# Altium schematic sheet 盟升杯.SchDoc
size A3
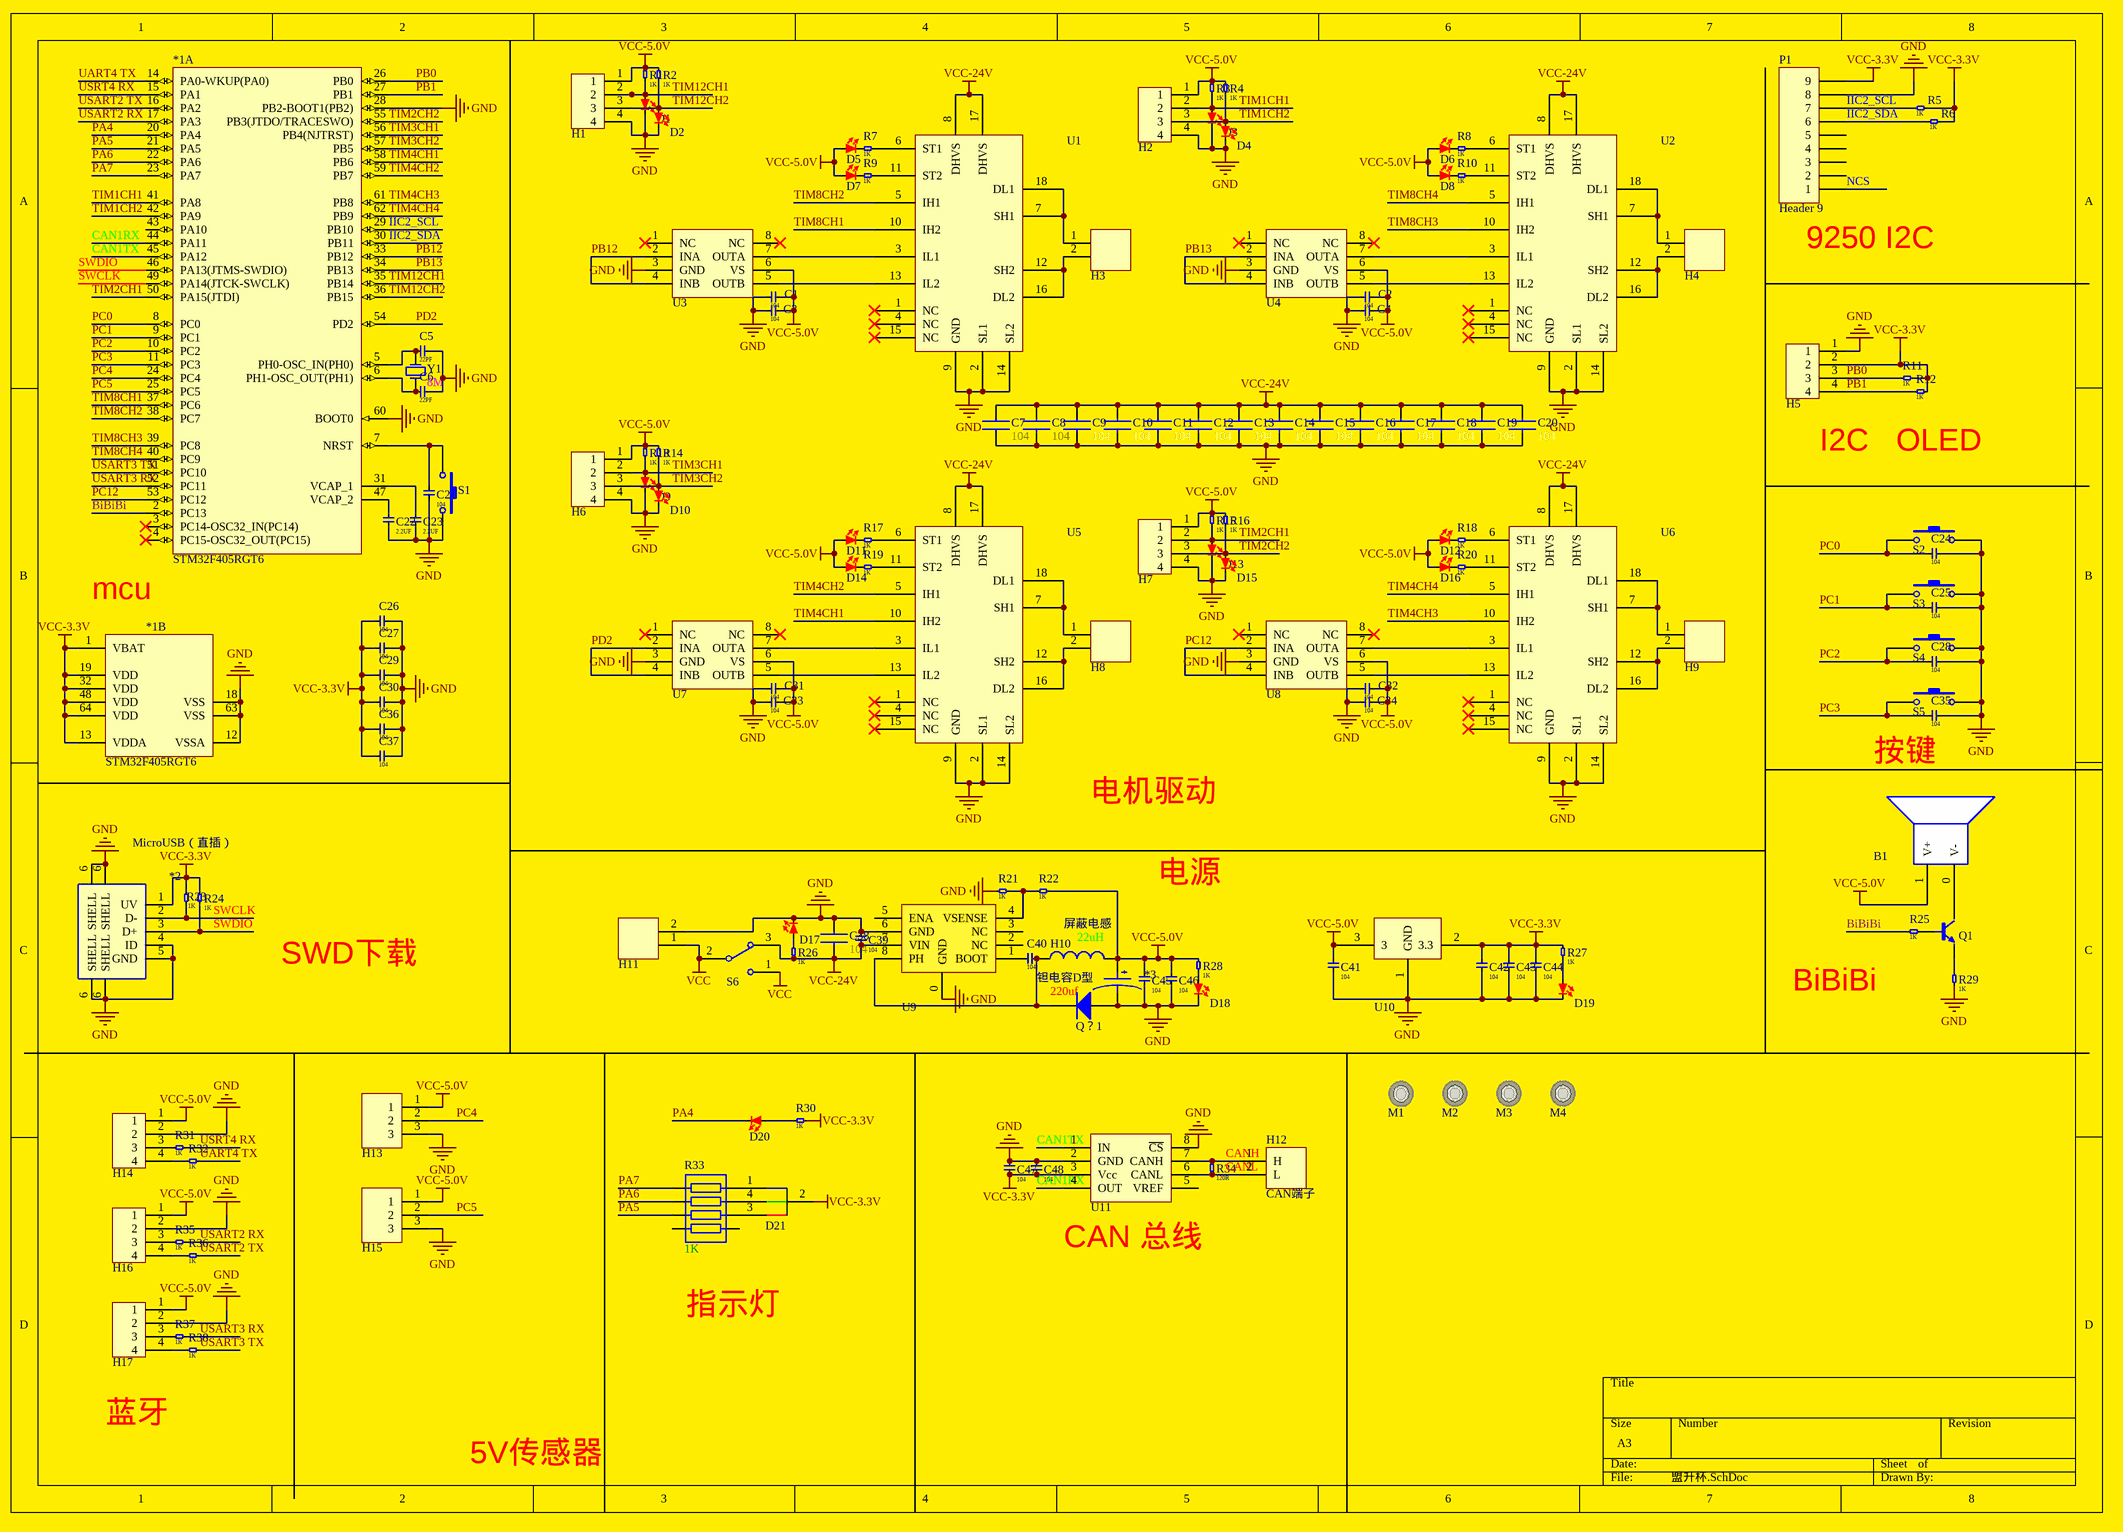
[diagram p0: 盟升杯.SchDoc]

## Parts
*1  STM32F405RGT6  [LQFP_64P]  (parts A,B of 2)
*2  MicroUSB（直插）  [MicroUSB（直插）]
*3  钽电容D型  [钽电容D型]
B1  KLJ-9032  [KLJ-9032]  (value not drawn)
C1  CAP0603  [CAP0603]  (value not drawn)
C2  CAP0603  [CAP0603]  (value not drawn)
C3  CAP0603  [CAP0603]  (value not drawn)
C4  CAP0603  [CAP0603]  (value not drawn)
C5  CAP0603  [CAP0603]  (value not drawn)
C6  CAP0603  [CAP0603]  (value not drawn)
C7  CAP1812  [CAP1812]  (value not drawn)
C8  CAP1812  [CAP1812]  (value not drawn)
C9  CAP1210  [CAP1210]  (value not drawn)
C10  CAP1210  [CAP1210]  (value not drawn)
C11  CAP1210  [CAP1210]  (value not drawn)
C12  CAP1210  [CAP1210]  (value not drawn)
C13  CAP1210  [CAP1210]  (value not drawn)
C14  CAP1210  [CAP1210]  (value not drawn)
C15  CAP1210  [CAP1210]  (value not drawn)
C16  CAP1210  [CAP1210]  (value not drawn)
C17  CAP1210  [CAP1210]  (value not drawn)
C18  CAP1210  [CAP1210]  (value not drawn)
C19  CAP1210  [CAP1210]  (value not drawn)
C20  CAP1210  [CAP1210]  (value not drawn)
C21  CAP0603  [CAP0603]  (value not drawn)
C22  CAP0603  [CAP0603]  (value not drawn)
C23  CAP0603  [CAP0603]  (value not drawn)
C24  CAP0603  [CAP0603]  (value not drawn)
C25  CAP0603  [CAP0603]  (value not drawn)
C26  CAP0603  [CAP0603]  (value not drawn)
C27  CAP0603  [CAP0603]  (value not drawn)
C28  CAP0603  [CAP0603]  (value not drawn)
C29  CAP0603  [CAP0603]  (value not drawn)
C30  CAP0603  [CAP0603]  (value not drawn)
C31  CAP0603  [CAP0603]  (value not drawn)
C32  CAP0603  [CAP0603]  (value not drawn)
C33  CAP0603  [CAP0603]  (value not drawn)
C34  CAP0603  [CAP0603]  (value not drawn)
C35  CAP0603  [CAP0603]  (value not drawn)
C36  CAP0603  [CAP0603]  (value not drawn)
C37  CAP0603  [CAP0603]  (value not drawn)
C38  CAP1812  [CAP1812]  (value not drawn)
C39  CAP0603  [CAP0603]  (value not drawn)
C40  CAP0603  [CAP0603]  (value not drawn)
C41  CAP0603  [CAP0603]  (value not drawn)
C42  CAP0603  [CAP0603]  (value not drawn)
C43  CAP0603  [CAP0603]  (value not drawn)
C44  CAP0603  [CAP0603]  (value not drawn)
C45  CAP0603  [CAP0603]  (value not drawn)
C46  CAP0603  [CAP0603]  (value not drawn)
C47  CAP0603  [CAP0603]  (value not drawn)
C48  104  [CAP]
D1  LED  [LED_0603_B]  (value not drawn)
D2  LED  [LED_0603_B]  (value not drawn)
D3  LED  [LED_0603_B]  (value not drawn)
D4  LED  [LED_0603_B]  (value not drawn)
D5  LED  [LED_0603_B]  (value not drawn)
D6  LED  [LED_0603_B]  (value not drawn)
D7  LED  [LED_0603_G]  (value not drawn)
D8  LED  [LED_0603_G]  (value not drawn)
D9  LED  [LED_0603_B]  (value not drawn)
D10  LED  [LED_0603_B]  (value not drawn)
D11  LED  [LED_0603_B]  (value not drawn)
D12  LED  [LED_0603_B]  (value not drawn)
D13  LED  [LED_0603_B]  (value not drawn)
D14  LED  [LED_0603_G]  (value not drawn)
D15  LED  [LED_0603_B]  (value not drawn)
D16  LED  [LED_0603_G]  (value not drawn)
D17  LED  [LED_0603_R]  (value not drawn)
D18  LED  [LED_0603_R]  (value not drawn)
D19  LED  [LED_0603_R]  (value not drawn)
D20  LED  [LED_0603_R]  (value not drawn)
D21  RGB  [RGB]  (value not drawn)
H1  H4  [H4_WHITE]  (value not drawn)
H2  H4  [H4_WHITE]  (value not drawn)
H3  H2 POWER  [H2 POWER]  (value not drawn)
H4  H2 POWER  [H2 POWER]  (value not drawn)
H5  H4  [H4]  (value not drawn)
H6  H4  [H4_WHITE]  (value not drawn)
H7  H4  [H4_WHITE]  (value not drawn)
H8  H2 POWER  [H2 POWER]  (value not drawn)
H9  H2 POWER  [H2 POWER]  (value not drawn)
H10  屏蔽电感  [屏蔽7.2*7.2]
H11  H2 POWER  [H2 POWER]  (value not drawn)
H12  CAN端子  [CAN端子]
H13  H3  [H3_WHITE]  (value not drawn)
H14  H4  [H4]  (value not drawn)
H15  H3  [H3_WHITE]  (value not drawn)
H16  H4  [H4]  (value not drawn)
H17  H4  [H4]  (value not drawn)
M1  M3过孔  [M3过孔]  (value not drawn)
M2  M3过孔  [M3过孔]  (value not drawn)
M3  M3过孔  [M3过孔]  (value not drawn)
M4  M3过孔  [M3过孔]  (value not drawn)
P1  Header 9  [HDR1X9]
Q1  2N5551  [2N5551]  (value not drawn)
Q？1  SS34  [SS34]  (value not drawn)
R1  电阻R  [R0603]  (value not drawn)
R2  电阻R  [R0603]  (value not drawn)
R3  电阻R  [R0603]  (value not drawn)
R4  电阻R  [R0603]  (value not drawn)
R5  电阻R  [R0603]  (value not drawn)
R6  电阻R  [R0603]  (value not drawn)
R7  电阻R  [R0603]  (value not drawn)
R8  电阻R  [R0603]  (value not drawn)
R9  电阻R  [R0603]  (value not drawn)
R10  电阻R  [R0603]  (value not drawn)
R11  电阻R  [R0603]  (value not drawn)
R12  电阻R  [R0805]  (value not drawn)
R13  电阻R  [R0603]  (value not drawn)
R14  电阻R  [R0603]  (value not drawn)
R15  电阻R  [R0603]  (value not drawn)
R16  电阻R  [R0603]  (value not drawn)
R17  电阻R  [R0603]  (value not drawn)
R18  电阻R  [R0603]  (value not drawn)
R19  电阻R  [R0603]  (value not drawn)
R20  电阻R  [R0603]  (value not drawn)
R21  电阻R  [R0603]  (value not drawn)
R22  电阻R  [R0603]  (value not drawn)
R23  电阻R  [R0603]  (value not drawn)
R24  电阻R  [R0603]  (value not drawn)
R25  电阻R  [R0603]  (value not drawn)
R26  电阻R  [R0603]  (value not drawn)
R27  电阻R  [R0603]  (value not drawn)
R28  电阻R  [R0603]  (value not drawn)
R29  电阻R  [R0603]  (value not drawn)
R30  电阻R  [R0603]  (value not drawn)
R31  电阻R  [R0603]  (value not drawn)
R32  电阻R  [R0603]  (value not drawn)
R33  1K*4排阻  [1K*4排阻]  (value not drawn)
R34  电阻R  [R0603]  (value not drawn)
R35  电阻R  [R0603]  (value not drawn)
R36  电阻R  [R0603]  (value not drawn)
R37  电阻R  [R0603]  (value not drawn)
R38  电阻R  [R0603]  (value not drawn)
S1  SWITCH  [SWITCH]  (value not drawn)
S2  SWITCH  [SWITCH]  (value not drawn)
S3  SWITCH  [SWITCH]  (value not drawn)
S4  SWITCH  [SWITCH]  (value not drawn)
S5  SWITCH  [SWITCH]  (value not drawn)
S6  拨动开关  [拨动开关]  (value not drawn)
U1  BTS7810K  [BTS7810K]  (value not drawn)
U2  BTS7810K  [BTS7810K]  (value not drawn)
U3  MIC4428  [SOIC-NB-8]  (value not drawn)
U4  MIC4428  [SOIC-NB-8]  (value not drawn)
U5  BTS7810K  [BTS7810K]  (value not drawn)
U6  BTS7810K  [BTS7810K]  (value not drawn)
U7  MIC4428  [SOIC-NB-8]  (value not drawn)
U8  MIC4428  [SOIC-NB-8]  (value not drawn)
U9  TPS5430  [POWERPARK SOP8]  (value not drawn)
U10  AMS1117  [AMS1117]  (value not drawn)
U11  VP230  [VP230]  (value not drawn)
Y1  XTAL  [XTAL]  (value not drawn)

## Nets
GND: *1.12(VSSA) *1.18(VSS) *1.28(PB2-BOOT1(PB2)) *1.60(BOOT0) *1.63(VSS) *2.4(ID) *2.5(GND) *2.6(SHELL) *3.1 C1.2 C2.2 C3.2 C4.2 C5.2 C6.2 C7.1 C8.1 C9.1 C10.1 C11.1 C12.1 C13.1 C14.1 C15.1 C16.1 C17.1 C18.1 C19.1 C20.1 C21.1 C22.1 C23.1 C24.2 C25.2 C26.1 C27.2 C28.2 C29.2 C30.2 C31.2 C32.2 C33.2 C34.2 C35.2 C36.2 C37.2 C38.2 C39.2 C41.1 C42.1 C43.1 C44.1 C45.1 C46.1 C47.2 C48.2 D1.2 D2.2 D3.2 D4.2 D9.2 D10.2 D13.2 D15.2 D17.2 D18.2 D19.2 H1.4 H2.4 H5.1 H6.4 H7.4 H11.2 H13.3 H14.2 H15.3 H16.2 H17.2 P1.8 Q？1.1(A) R21.1 R29.1 S1.2 S2.2 S3.2 S4.2 S5.2 U1.2(SL1) U1.9(GND) U1.14(SL2) U2.2(SL1) U2.9(GND) U2.14(SL2) U3.3(GND) U4.3(GND) U5.2(SL1) U5.9(GND) U5.14(SL2) U6.2(SL1) U6.9(GND) U6.14(SL2) U7.3(GND) U8.3(GND) U9.0(GND) U9.6(GND) U10.1(GND) U11.2(GND) U11.8(~{CS})
VCC: H11.1 S6.1 S6.2
VCC-3.3V: *1.1(VBAT) *1.13(VDDA) *1.19(VDD) *1.32(VDD) *1.48(VDD) *1.64(VDD) *2.1(UV) C26.2 C27.1 C29.1 C30.1 C36.1 C37.1 C42.2 C43.2 C44.2 C47.1 C48.1 D21.2(OUT) H5.2 P1.9 R5.2 R6.2 R11.2 R12.2 R23.2 R24.2 R27.1 R30.1 U10.2(3.3) U11.3(Vcc)
VCC-5.0V: *3.2 B1.1(V+) C1.1 C2.1 C3.1 C4.1 C31.1 C32.1 C33.1 C34.1 C41.2 C45.2 C46.2 D5.1 D6.1 D7.1 D8.1 D11.1 D12.1 D14.1 D16.1 H1.1 H2.1 H6.1 H7.1 H10.2 H13.1 H14.1 H15.1 H16.1 H17.1 R1.2 R2.2 R3.2 R4.2 R13.2 R14.2 R15.2 R16.2 R22.2 R28.1 U3.6(VS) U4.6(VS) U7.6(VS) U8.6(VS) U10.3
VCC-24V: C7.2 C8.2 C9.2 C10.2 C11.2 C12.2 C13.2 C14.2 C15.2 C16.2 C17.2 C18.2 C19.2 C20.2 C38.1 C39.1 R26.1 S6.3 U1.8(DHVS) U1.17(DHVS) U2.8(DHVS) U2.17(DHVS) U5.8(DHVS) U5.17(DHVS) U6.8(DHVS) U6.17(DHVS) U9.7(VIN)
BiBiBi: *1.2(PC13) R25.1
CAN1RX: *1.44(PA11) U11.4(OUT)
CAN1TX: *1.45(PA12) U11.1(IN)
CANH: H12.1(H) R34.2 U11.7(CANH)
CANL: H12.2(L) R34.1 U11.6(CANL)
IIC2_SCL: *1.29(PB10) P1.7 R5.1
IIC2_SDA: *1.30(PB11) P1.6 R6.1
NCS: P1.1
PA4: *1.20(PA4) D20.2
PA5: *1.21(PA5) R33.4
PA6: *1.22(PA6) R33.6
PA7: *1.23(PA7) R33.8
PB0: *1.26(PB0) H5.3 R11.1
PB1: *1.27(PB1) H5.4 R12.1
PB12: *1.33(PB12) U3.2(INA) U3.4(INB)
PB13: *1.34(PB13) U4.2(INA) U4.4(INB)
PC0: *1.8(PC0) C24.1 S2.1
PC1: *1.9(PC1) C25.1 S3.1
PC2: *1.10(PC2) C28.1 S4.1
PC3: *1.11(PC3) C35.1 S5.1
PC4: *1.24(PC4) H13.2
PC5: *1.25(PC5) H15.2
PC12: *1.53(PC12) U8.2(INA) U8.4(INB)
PD2: *1.54(PD2) U7.2(INA) U7.4(INB)
SWCLK: *1.49(PA14(JTCK-SWCLK)) *2.2(D-) R23.1
SWDIO: *1.46(PA13(JTMS-SWDIO)) *2.3(D+) R24.1
TIM1CH1: *1.41(PA8) D3.1 H2.2 R3.1
TIM1CH2: *1.42(PA9) D4.1 H2.3 R4.1
TIM2CH1: *1.50(PA15(JTDI)) D13.1 H7.2 R15.1
TIM2CH2: *1.55(PB3(JTDO/TRACESWO)) D15.1 H7.3 R16.1
TIM3CH1: *1.56(PB4(NJTRST)) D9.1 H6.2 R13.1
TIM3CH2: *1.57(PB5) D10.1 H6.3 R14.1
TIM4CH1: *1.58(PB6) U5.10(IH2)
TIM4CH2: *1.59(PB7) U5.5(IH1)
TIM4CH3: *1.61(PB8) U6.10(IH2)
TIM4CH4: *1.62(PB9) U6.5(IH1)
TIM8CH1: *1.37(PC6) U1.10(IH2)
TIM8CH2: *1.38(PC7) U1.5(IH1)
TIM8CH3: *1.39(PC8) U2.10(IH2)
TIM8CH4: *1.40(PC9) U2.5(IH1)
TIM12CH1: *1.35(PB14) D1.1 H1.2 R1.1
TIM12CH2: *1.36(PB15) D2.1 H1.3 R2.1
UART4 TX: *1.14(PA0-WKUP(PA0)) R32.2
USART2 RX: *1.17(PA3) R35.2
USART2 TX: *1.16(PA2) R36.2
USART3 RX: *1.52(PC11) R37.2
USART3 TX: *1.51(PC10) R38.2
USRT4 RX: *1.15(PA1) R31.2
Net*1_5: *1.5(PH0-OSC_IN(PH0)) C5.1 Y1.2(OSC2)
Net*1_6: *1.6(PH1-OSC_OUT(PH1)) C6.1 Y1.1(OSC1)
Net*1_7: *1.7(NRST) C21.2 S1.1
Net*1_31: *1.31(VCAP_1) C23.2
Net*1_47: *1.47(VCAP_2) C22.2
NetB1_0: B1.0(V-) Q1.3(c)
NetC40_1: C40.1 U9.1(BOOT)
NetC40_2: C40.2 H10.1 Q？1.2(K) U9.8(PH)
NetD5_2: D5.2 R7.1
NetD6_2: D6.2 R8.1
NetD7_2: D7.2 R9.1
NetD8_2: D8.2 R10.1
NetD11_2: D11.2 R17.1
NetD12_2: D12.2 R18.1
NetD14_2: D14.2 R19.1
NetD16_2: D16.2 R20.1
NetD17_1: D17.1 R26.2
NetD18_1: D18.1 R28.2
NetD19_1: D19.1 R27.2
NetD20_1: D20.1 R30.2
NetD21_1: D21.1(OUT) R33.7
NetD21_3: D21.3(OUT) R33.3
NetD21_4: D21.4(OUT) R33.5
NetH3_1: H3.1 U1.7(SH1) U1.18(DL1)
NetH3_2: H3.2 U1.12(SH2) U1.16(DL2)
NetH4_1: H4.1 U2.7(SH1) U2.18(DL1)
NetH4_2: H4.2 U2.12(SH2) U2.16(DL2)
NetH8_1: H8.1 U5.7(SH1) U5.18(DL1)
NetH8_2: H8.2 U5.12(SH2) U5.16(DL2)
NetH9_1: H9.1 U6.7(SH1) U6.18(DL1)
NetH9_2: H9.2 U6.12(SH2) U6.16(DL2)
NetH14_3: H14.3 R31.1
NetH14_4: H14.4 R32.1
NetH16_3: H16.3 R35.1
NetH16_4: H16.4 R36.1
NetH17_3: H17.3 R37.1
NetH17_4: H17.4 R38.1
NetQ1_1: Q1.1(b) R25.2
NetQ1_2: Q1.2(e) R29.2
NetR7_2: R7.2 U1.6(ST1)
NetR8_2: R8.2 U2.6(ST1)
NetR9_2: R9.2 U1.11(ST2)
NetR10_2: R10.2 U2.11(ST2)
NetR17_2: R17.2 U5.6(ST1)
NetR18_2: R18.2 U6.6(ST1)
NetR19_2: R19.2 U5.11(ST2)
NetR20_2: R20.2 U6.11(ST2)
NetR21_2: R21.2 R22.1 U9.4(VSENSE)
NetU1_3: U1.3(IL1) U3.7(OUTA)
NetU1_13: U1.13(IL2) U3.5(OUTB)
NetU2_3: U2.3(IL1) U4.7(OUTA)
NetU2_13: U2.13(IL2) U4.5(OUTB)
NetU5_3: U5.3(IL1) U7.7(OUTA)
NetU5_13: U5.13(IL2) U7.5(OUTB)
NetU6_3: U6.3(IL1) U8.7(OUTA)
NetU6_13: U6.13(IL2) U8.5(OUTB)

Not connected (* = marked no-connect by the designer): *1 3(PC14-OSC32_IN(PC14))* 4(PC15-OSC32_OUT(PC15))* 43(PA10); P1 2 3 4 5; R33 1 2; U1 1(NC)* 4(NC)* 15(NC)*; U2 1(NC)* 4(NC)* 15(NC)*; U3 1(NC)* 8(NC)*; U4 1(NC)* 8(NC)*; U5 1(NC)* 4(NC)* 15(NC)*; U6 1(NC)* 4(NC)* 15(NC)*; U7 1(NC)* 8(NC)*; U8 1(NC)* 8(NC)*; U9 2(NC) 3(NC) 5(ENA); U11 5(VREF)

## Notes on the sheet
- (near P1) 9250 I2C
- I2C   OLED
- (near *1) mcu
- 按键
- 电机驱动
- 电源
- SWD下载
- BiBiBi
- (near U11) CAN 总线
- 指示灯
- 蓝牙
- 5V传感器
- (in symbol 1K*4排阻) 1K
- (in symbol CAP0603) 104; 2.2UF; 22PF
- (in symbol CAP1210) 104
- (in symbol CAP1812) 104
- (in symbol XTAL) 8M
- (in symbol 屏蔽电感) 22uH
- (in symbol 电阻R) 1K; 120R
- (in symbol 钽电容D型) 220uf

## Library data of the parts
B1 = KLJ-9032: 贴片蜂鸣器
C48 = CAP0805
D21 = RGB: 三色LED
H1 H2 H5-H7 H14 H16 H17 = H4: 排针
H13 H15 = H3: 排针
P1 = Header 9: Header, 9-Pin; LatestRevisionDate: 17-Jul-2002; LatestRevisionNote: Re-released for DXP Platform.; Publisher: Altium Limited
Q1 = 2N5551: NPN三极管
Q？1 = SS34: 肖特基二极管
S1-S5 = SWITCH: 按键
S6 = 拨动开关: 扭子拨动开关
U1 U2 U5 U6 = BTS7810K: 全桥驱动
U3 U4 U7 U8 = MIC4428: 缓冲器
U9 = TPS5430: 开关稳压芯片
U10 = AMS1117: 3.3V稳压电源
U11 = VP230: CAN 芯片
Y1 = XTAL: 晶振